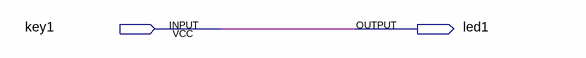
[diagram p0: schematic sheet]
// Quartus schematic demo.bdf as structural Verilog: 0 symbols, 2 pins
module demo (
  input  key1,
  output led1
);


  assign led1 = key1;
endmodule
